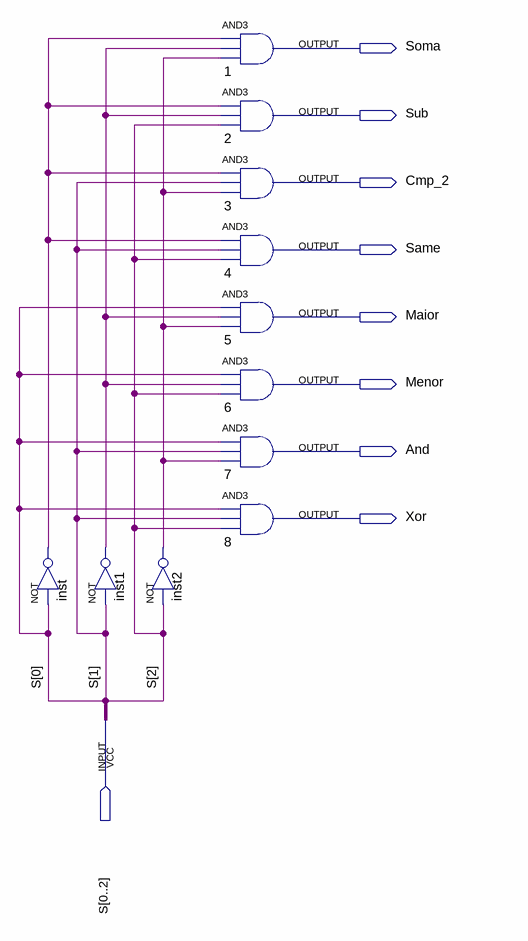
[diagram p0: schematic sheet]
// Quartus schematic Seletor.bdf as structural Verilog: 11 symbols, 9 pins
module Seletor (
  input  [0:2] S,
  output Soma,
  output Sub,
  output Cmp_2,
  output Same,
  output Maior,
  output Menor,
  output And,
  output Xor
);

  wire inst1_out, inst2_out, inst_out;

  not inst (inst_out, S[0]);
  not inst1 (inst1_out, S[1]);
  not inst2 (inst2_out, S[2]);
  and u_1 (Soma, inst_out, inst1_out, inst2_out);
  and u_2 (Sub, inst_out, inst1_out, S[2]);
  and u_3 (Cmp_2, inst_out, S[1], inst2_out);
  and u_4 (Same, inst_out, S[1], S[2]);
  and u_5 (Maior, S[0], inst1_out, inst2_out);
  and u_6 (Menor, S[0], inst1_out, S[2]);
  and u_7 (And, S[0], S[1], inst2_out);
  and u_8 (Xor, S[0], S[1], S[2]);
endmodule
